# EAGLE design RetroESP32 (EAGLE 9.6.2)

## Sheet 1 of 4: Board and Logos
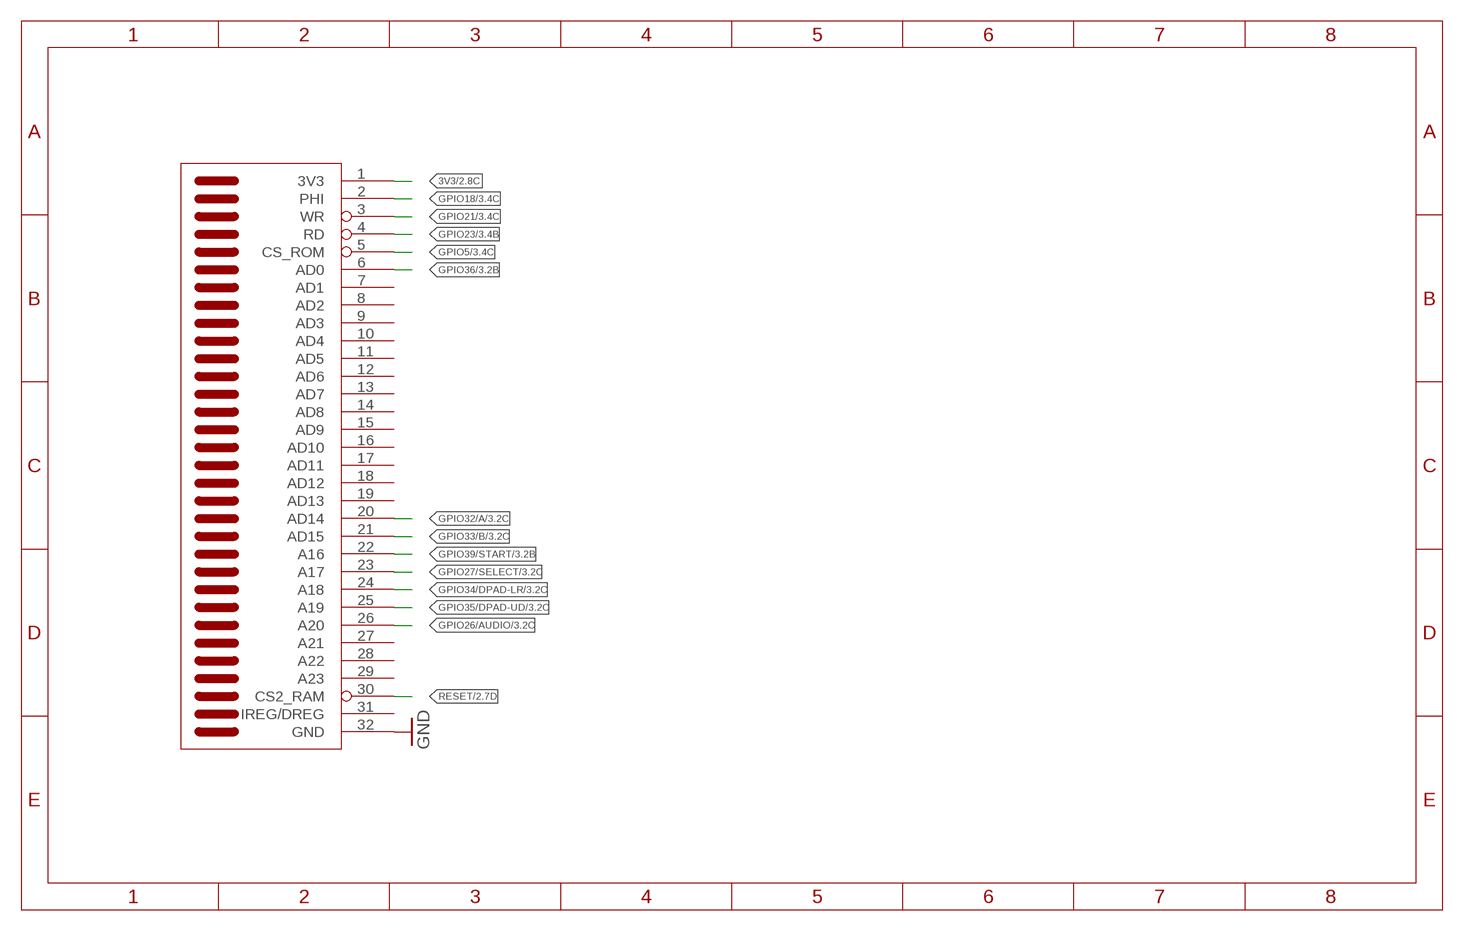
[diagram p0: schematic, sheet 1]

### Parts
U$2  GBA_CARTLARGE  [GBCART]

### Nets
3V3: U$2.1(3V3) ; also sheet 2,3,4
GND: U$2.32(GND) ; also sheet 2,3,4
GPIO5: U$2.5(CS_ROM) ; also sheet 3
GPIO18: U$2.2(PHI) ; also sheet 3,4
GPIO21: U$2.3(WR) ; also sheet 3
GPIO23: U$2.4(RD) ; also sheet 3,4
GPIO26/AUDIO: U$2.26(A20) ; also sheet 3
GPIO27/SELECT: U$2.23(A17) ; also sheet 3
GPIO32/A: U$2.20(AD14) ; also sheet 3
GPIO33/B: U$2.21(AD15) ; also sheet 3
GPIO34/DPAD-LR: U$2.24(A18) ; also sheet 3
GPIO35/DPAD-UD: U$2.25(A19) ; also sheet 3
GPIO36: U$2.6(AD0) ; also sheet 3
GPIO39/START: U$2.22(A16) ; also sheet 3
RESET: U$2.30(CS2_RAM) ; also sheet 2,3
Unconnected: U$2.7(AD1) U$2.8(AD2) U$2.9(AD3) U$2.10(AD4) U$2.11(AD5) U$2.12(AD6) U$2.13(AD7) U$2.14(AD8) U$2.15(AD9) U$2.16(AD10) U$2.17(AD11) U$2.18(AD12) U$2.19(AD13) U$2.27(A21) U$2.28(A22) U$2.29(A23) U$2.31(IREG/DREG)

## Sheet 2 of 4: USB UART
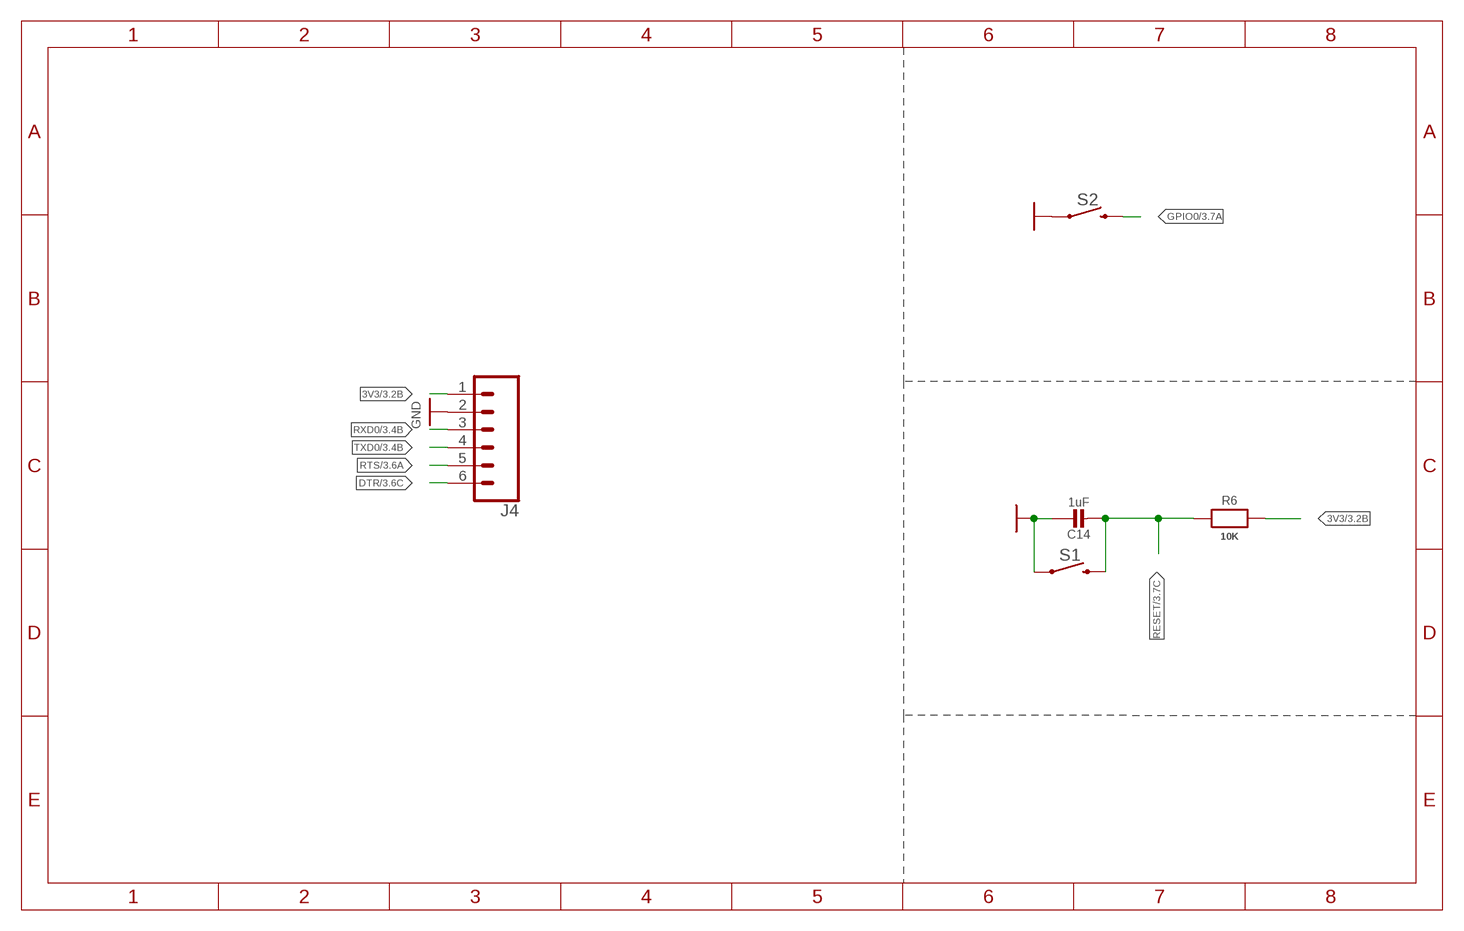
[diagram p1: schematic, sheet 2]

### Parts
C14  1uF  CAP_CERAMIC  [0603-MINI-CAP]
J4  CONN_06NO_SILK_NO_POP  [1X06_NO_SILK]
R6  10K  RESISTOR0603MINI  [0603-MINI]
S1  SWITCHES_MOMENTARY-SWITCH-SPST-SMD-4.6X2.8MM  [SWITCHES_TACTILE_SWITCH_SMD_4.6X2.8MM]
S2  SWITCHES_MOMENTARY-SWITCH-SPST-SMD-4.6X2.8MM  [SWITCHES_TACTILE_SWITCH_SMD_4.6X2.8MM]

### Nets
3V3: J4.1 R6.2 ; also sheet 1,3,4
DTR: J4.6 ; also sheet 3
GND: C14.1 J4.2 S1.1 S1.2 S2.1 S2.2 ; also sheet 1,3,4
GPIO0: S2.3 S2.4 ; also sheet 3
RESET: C14.2 R6.1 S1.3 S1.4 ; also sheet 1,3
RTS: J4.5 ; also sheet 3
RXD0: J4.3 ; also sheet 3
TXD0: J4.4 ; also sheet 3

## Sheet 3 of 4: ESP32 CORE
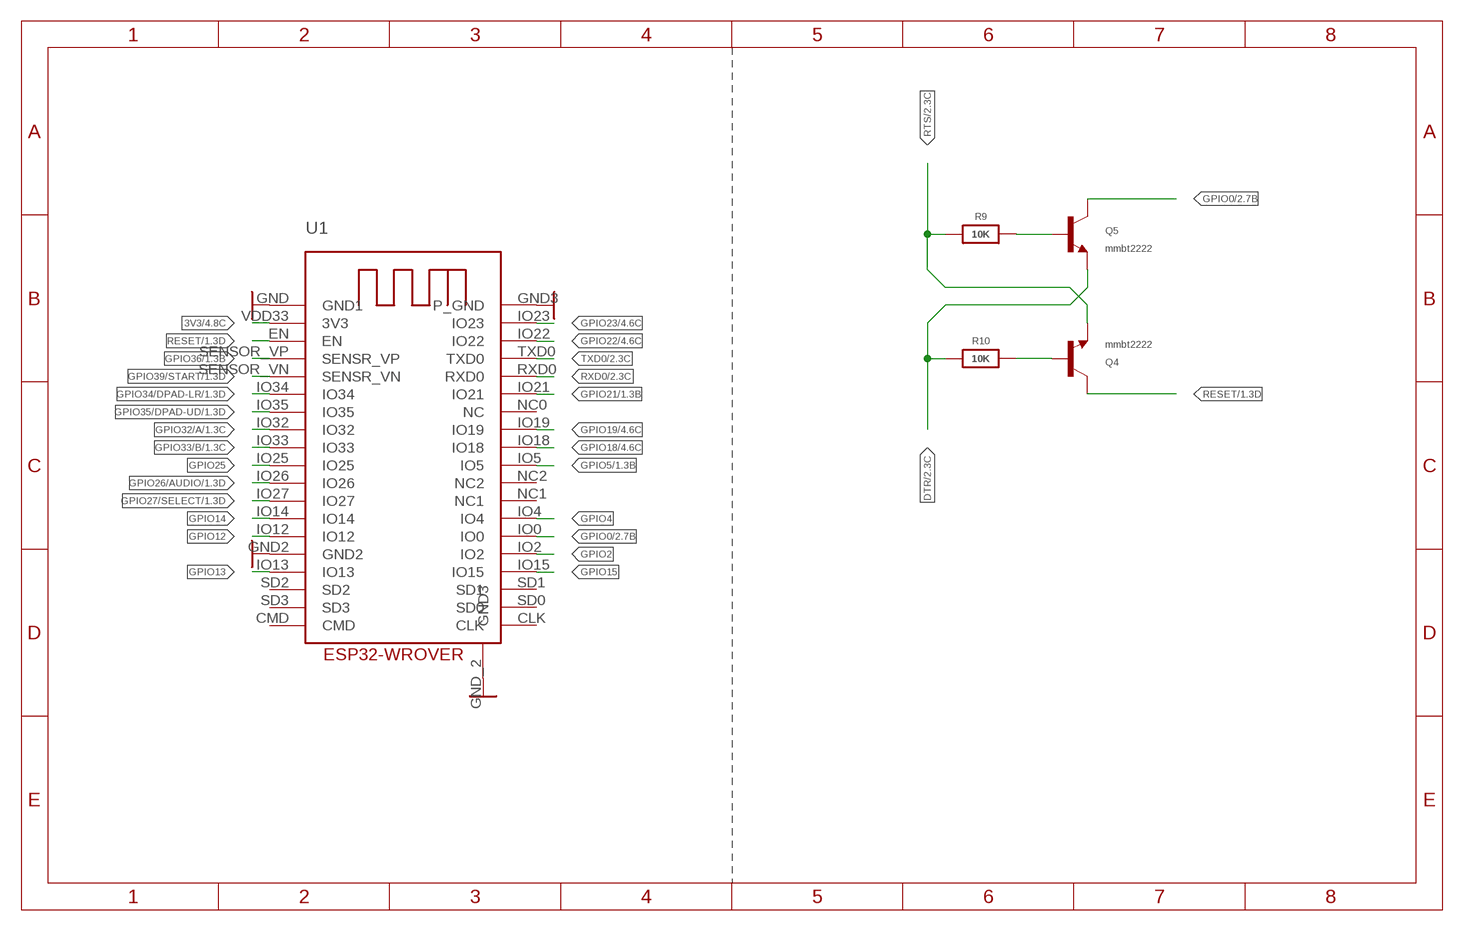
[diagram p2: schematic, sheet 3]

### Parts
Q4  mmbt2222  TRANSISTOR_NPNSOT23-3  [SOT23-3]
Q5  mmbt2222  TRANSISTOR_NPNSOT23-3  [SOT23-3]
R9  10K  RESISTOR0603MINI  [0603-MINI]
R10  10K  RESISTOR0603MINI  [0603-MINI]
U1  ESP32-WROVER_ESP32-WROVER  [ESP32-WROVER_ESP32-WROVER]

### Nets
3V3: U1.VDD33(3V3) ; also sheet 1,2,4
DTR: Q5.2(E) R10.1 ; also sheet 2
GND: U1.GND2 U1.GND3(P_GND) U1.GND(GND1) U1.GND_2(GND3) ; also sheet 1,2,4
GPIO0: Q5.3(C) U1.IO0 ; also sheet 2
GPIO2: U1.IO2
GPIO4: U1.IO4
GPIO5: U1.IO5 ; also sheet 1
GPIO12: U1.IO12
GPIO13: U1.IO13
GPIO14: U1.IO14
GPIO15: U1.IO15
GPIO18: U1.IO18 ; also sheet 1,4
GPIO19: U1.IO19 ; also sheet 4
GPIO21: U1.IO21 ; also sheet 1
GPIO22: U1.IO22 ; also sheet 4
GPIO23: U1.IO23 ; also sheet 1,4
GPIO25: U1.IO25
GPIO26/AUDIO: U1.IO26 ; also sheet 1
GPIO27/SELECT: U1.IO27 ; also sheet 1
GPIO32/A: U1.IO32 ; also sheet 1
GPIO33/B: U1.IO33 ; also sheet 1
GPIO34/DPAD-LR: U1.IO34 ; also sheet 1
GPIO35/DPAD-UD: U1.IO35 ; also sheet 1
GPIO36: U1.SENSOR_VP(SENSR_VP) ; also sheet 1
GPIO39/START: U1.SENSOR_VN(SENSR_VN) ; also sheet 1
RESET: Q4.3(C) U1.EN ; also sheet 1,2
RST-RES: Q4.1(B) R10.2
RTS: Q4.2(E) R9.1 ; also sheet 2
RTS-RES: Q5.1(B) R9.2
RXD0: U1.RXD0 ; also sheet 2
TXD0: U1.TXD0 ; also sheet 2
Unconnected: U1.CLK U1.CMD U1.NC0(NC) U1.NC1 U1.NC2 U1.SD0 U1.SD1 U1.SD2 U1.SD3

## Sheet 4 of 4: USB + BATTERY
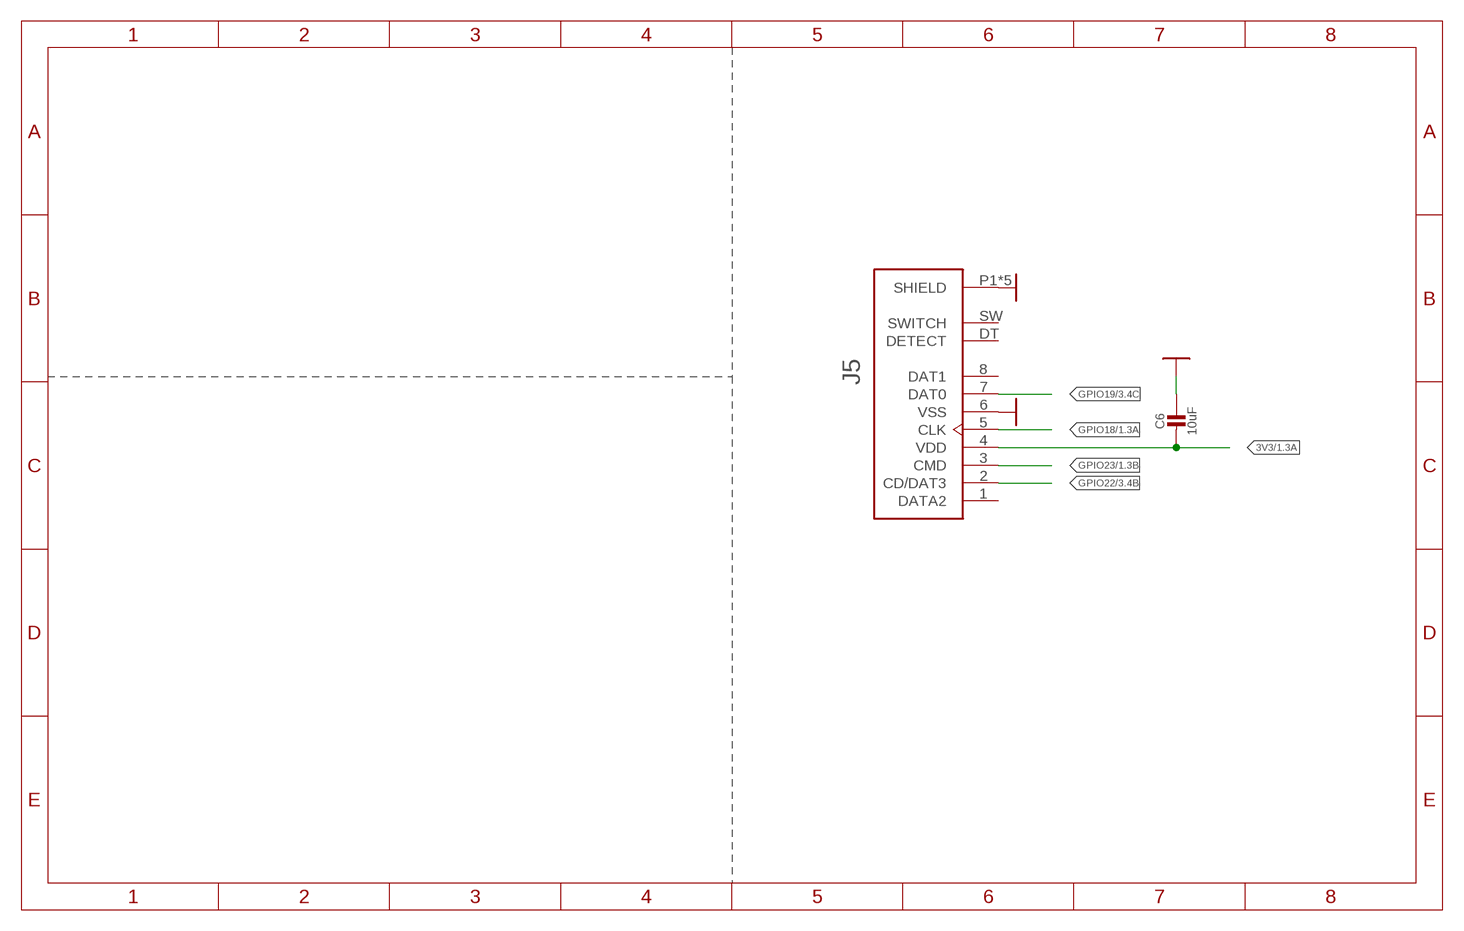
[diagram p3: schematic, sheet 4]

### Parts
C6  10uF  CAP_CERAMIC  [0603-MINI-CAP]
J5  503182-1852_503182-1852  [503182-1852_MOLEX_503182-1852]

### Nets
3V3: C6.2 J5.4(VDD) ; also sheet 1,2,3
GND: C6.1 J5.6(VSS) J5.P1(SHIELD) J5.P2(SHIELD) J5.P3(SHIELD) J5.P4(SHIELD) J5.P5(SHIELD) ; also sheet 1,2,3
GPIO18: J5.5(CLK) ; also sheet 1,3
GPIO19: J5.7(DAT0) ; also sheet 3
GPIO22: J5.2(CD/DAT3) ; also sheet 3
GPIO23: J5.3(CMD) ; also sheet 1,3
Unconnected: J5.1(DATA2) J5.8(DAT1) J5.DT(DETECT) J5.SW(SWITCH)

## Library data of the parts
C6 = RetroESP32:CAP_CERAMIC: Ceramic Capacitors For new designs, use the packages preceded by an '_' character since they are more reliable: The following footprints should be used on most boards: _0402 - Standard footprint for regular board layouts _0603 - Standard footprint for regular board layouts _0805 - Standard footprint for regular board layouts _1206 - Standard footprint for regular board layouts For extremely tight-pitch boards where space is at a premium, the following 'micro-pitch' footprints can be used (smaller pads, no silkscreen outline, etc.): _0402MP - Micro-pitch footprint for very dense/compact boards _0603MP - Micro-pitch footprint for very dense/compact boards _0805MP - Micro-pitch footprint for very dense/compact boards _1206MP - Micro-pitch footprint for very dense/compact boards; MPN: CL10A106MP8NNNC
C14 = RetroESP32:CAP_CERAMIC: Ceramic Capacitors For new designs, use the packages preceded by an '_' character since they are more reliable: The following footprints should be used on most boards: _0402 - Standard footprint for regular board layouts _0603 - Standard footprint for regular board layouts _0805 - Standard footprint for regular board layouts _1206 - Standard footprint for regular board layouts For extremely tight-pitch boards where space is at a premium, the following 'micro-pitch' footprints can be used (smaller pads, no silkscreen outline, etc.): _0402MP - Micro-pitch footprint for very dense/compact boards _0603MP - Micro-pitch footprint for very dense/compact boards _0805MP - Micro-pitch footprint for very dense/compact boards _1206MP - Micro-pitch footprint for very dense/compact boards; MPN: CL10A105KP8NNNC
J4 = SparkFun-Connectors:CONN_06: Multi connection point. Often used as Generic Header-pin footprint for 0.1 inch spaced/style header connections On any of the 0.1 inch spaced packages, you can populate with these: Break Away Headers - Straight <https://www.sparkfun.com/products/116> (PRT-00116) Break Away Male Headers - Right Angle <https://www.sparkfun.com/products/553> (PRT-00553) Female Headers <https://www.sparkfun.com/products/115> (PRT-00115) Break Away Headers - Machine Pin <https://www.sparkfun.com/products/117> (PRT-00117) Break Away Female Headers - Swiss Machine Pin <https://www.sparkfun.com/products/743> (PRT-00743) Arduino Stackable Header - 6 Pin <https://www.sparkfun.com/products/9280> (PRT-09280) For SCREWTERMINALS and SPRING TERMINALS visit here: Screw Terimnals on SparkFun.com <https://www.sparkfun.com/search/results?term=Screw+Terminals> (5mm/3.5mm/2.54mm spacing) This device is also useful as a general connection point to wire up your design to another part of your project. Our various solder wires solder well into these plated through hole pads. Hook-Up Wire - Assortment (Stranded, 22 AWG) <https://www.sparkfun.com/products/11375> (PRT-11375) Hook-Up Wire - Assortment (Solid Core, 22 AWG) <https://www.sparkfun.com/products/11367> (PRT-11367) View the entire wire category on our website here <https://www.sparkfun.com/categories/141>
J5 = RetroESP32:503182-1852_503182-1852: Conn Micro SD Card M 8 POS 1.09mm Solder RA SMD Embossed T/R 0.5A/Contact; DESCRIPTION: MICRO SD NORMAL ULTRALOWPRO8CKTE; DIGI-KEY_PART_NUMBER: WM12834CT-ND; DIGI-KEY_PURCHASE_URL: https://www.digikey.ca/product-detail/en/molex/5031821852/WM12834CT-ND/5823232?utm_source=snapeda&utm_medium=aggregator&utm_campaign=symbol; MF: Molex; MP: 5031821852; MPN: 5031821852; PACKAGE: None
Q4 Q5 = RetroESP32:TRANSISTOR_NPN: Transistor NPN BJT configuration in SOT23 package. MMBT2222 is the common NPN we use. Double check BCE configuration again layout.; MPN: MMBT2222A-7-F
R6 R9 R10 = RetroESP32:RESISTOR: Resistors For new designs, use the packages preceded by an '_' character since they are more reliable: The following footprints should be used on most boards: _0402 - Standard footprint for regular board layouts _0603 - Standard footprint for regular board layouts _0805 - Standard footprint for regular board layouts _1206 - Standard footprint for regular board layouts For extremely tight-pitch boards where space is at a premium, the following 'micro-pitch' footprints can be used (smaller pads, no silkscreen outline, etc.): _0402MP - Micro-pitch footprint for very dense/compact boards _0603MP - Micro-pitch footprint for very dense/compact boards _0805MP - Micro-pitch footprint for very dense/compact boards _1206MP - Micro-pitch footprint for very dense/compact boards; MPN: ERJ-PA3J103V
S1 S2 = RetroESP32:SWITCHES_MOMENTARY-SWITCH-SPST: Momentary Switch (Pushbutton) - SPST Normally-open (NO) SPST momentary switches (buttons, pushbuttons). Variants PTH-12MM - 12mm square, through-hole Momentary Pushbutton Switch - 12mm Square <https://www.sparkfun.com/products/9190> (COM-09190) PTH-6.0MM, PTH-6.0MM-KIT - 6.0mm square, through-hole Mini Pushbutton Switch <https://www.sparkfun.com/products/97> (COM-00097) KIT package intended for soldering kit's - only one side of pads' copper is exposed. PTH-RIGHT-ANGLE-KIT - Right-angle, through-hole Right Angle Tactile Button <https://www.sparkfun.com/products/10791> - Used on SparkFun BigTime Watch Kit <https://www.sparkfun.com/products/11734> SMD-12MM - 12mm square, surface-mount Tactile Button - SMD (12mm) <https://www.sparkfun.com/products/12993> (COM-12993) Used on SparkFun PicoBoard <https://www.sparkfun.com/products/11888> SMD-4.5MM - 4.5mm Square Trackball Switch Used on SparkFun Blackberry Trackballer Breakout <https://www.sparkfun.com/products/13169> SMD-4.6MMX2.8MM - 4.60mm x 2.80mm, surface mount Used on SparkFun SAMD21 Mini Breakout <https://www.sparkfun.com/products/13664> SMD-5.2MM, SMD-5.2-REDUNDANT - 5.2mm square, surface-mount Mini Pushbutton Switch - SMD <https://www.sparkfun.com/products/8720> (COM-08720) Used on Arduino Pro Mini <https://www.sparkfun.com/products/11114> REDUNDANT package connects both switch circuits together SMD-6.0X3.5MM - 6.0 x 3.5mm, surface mount Momentary Reset Switch SMD <https://www.sparkfun.com/products/8229> (COM-08229) SMD-6.2MM-TALL - 6.2mm square, surface mount Tactile Button - SMD (6mm) <https://www.sparkfun.com/products/12992> Used on SparkFun Digital Sandbox <https://www.sparkfun.com/products/12651> SMD-RIGHT-ANGLE - Right-angle, surface mount Used on SparkFun Block for Intel® Edison - Arduino <https://www.sparkfun.com/products/13036>; MPN: KMR221GLFS; PROD_ID: COMP-12265; SF_SKU: COM-12993
U1 = RetroESP32:ESP32-WROVER_ESP32-WROVER; MPN: ESP32-WROVER (16MB)
U$2 = gameboy:GBA_CART

## Board
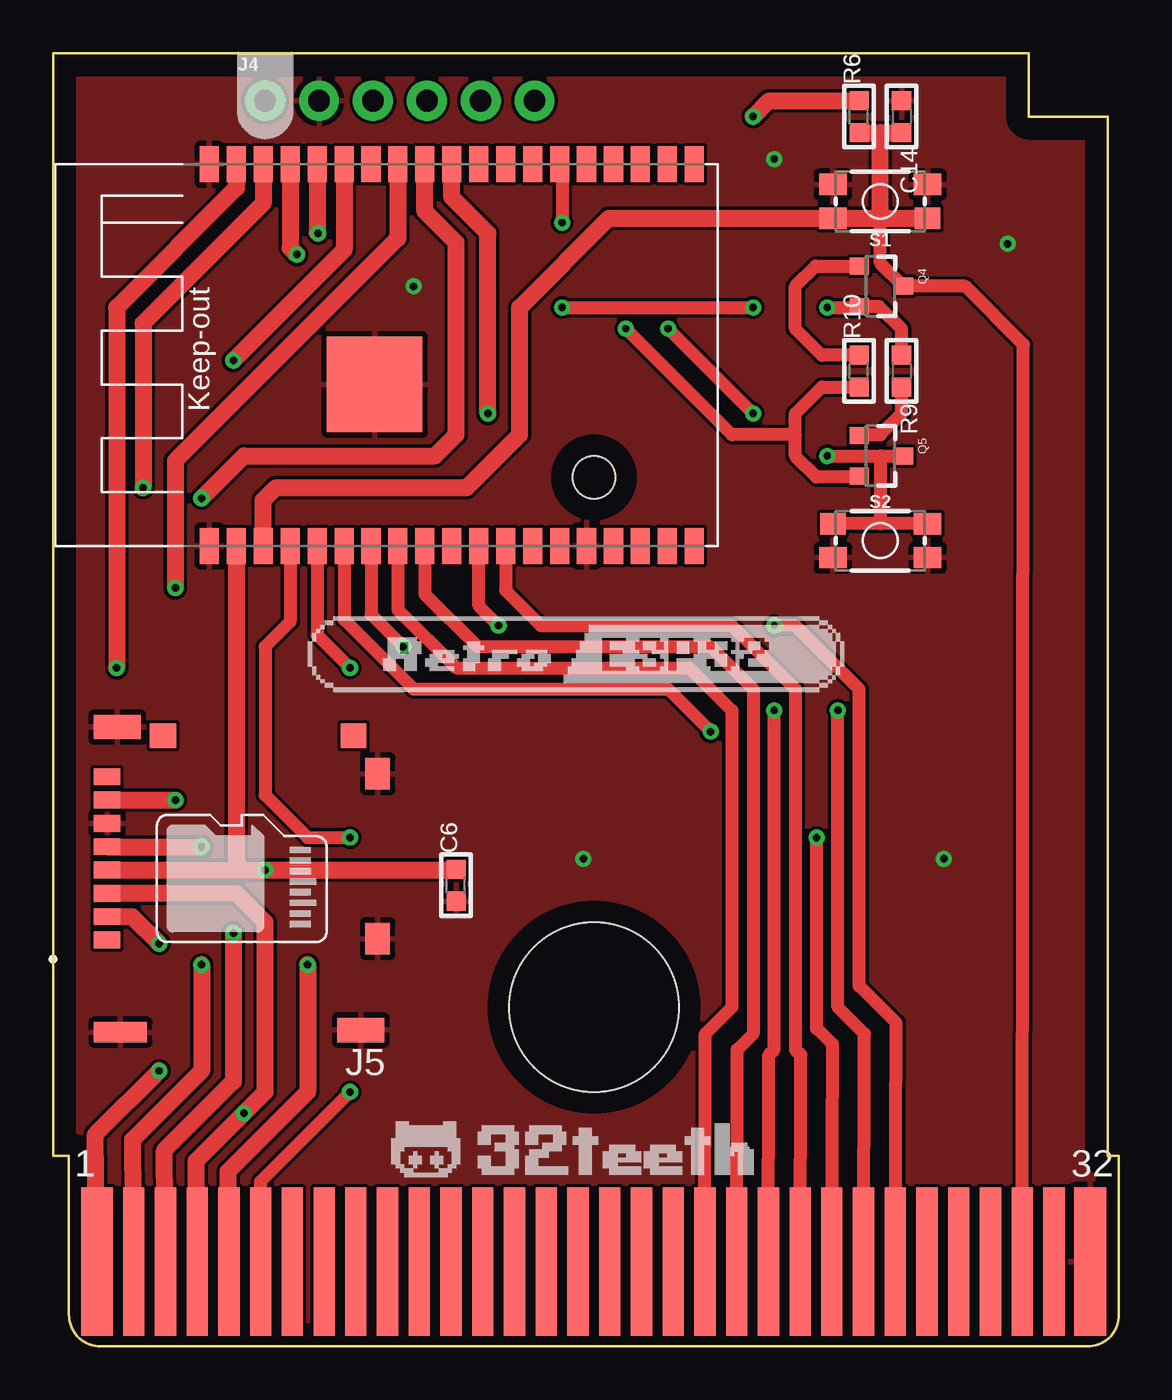
[diagram p4: board, top side]
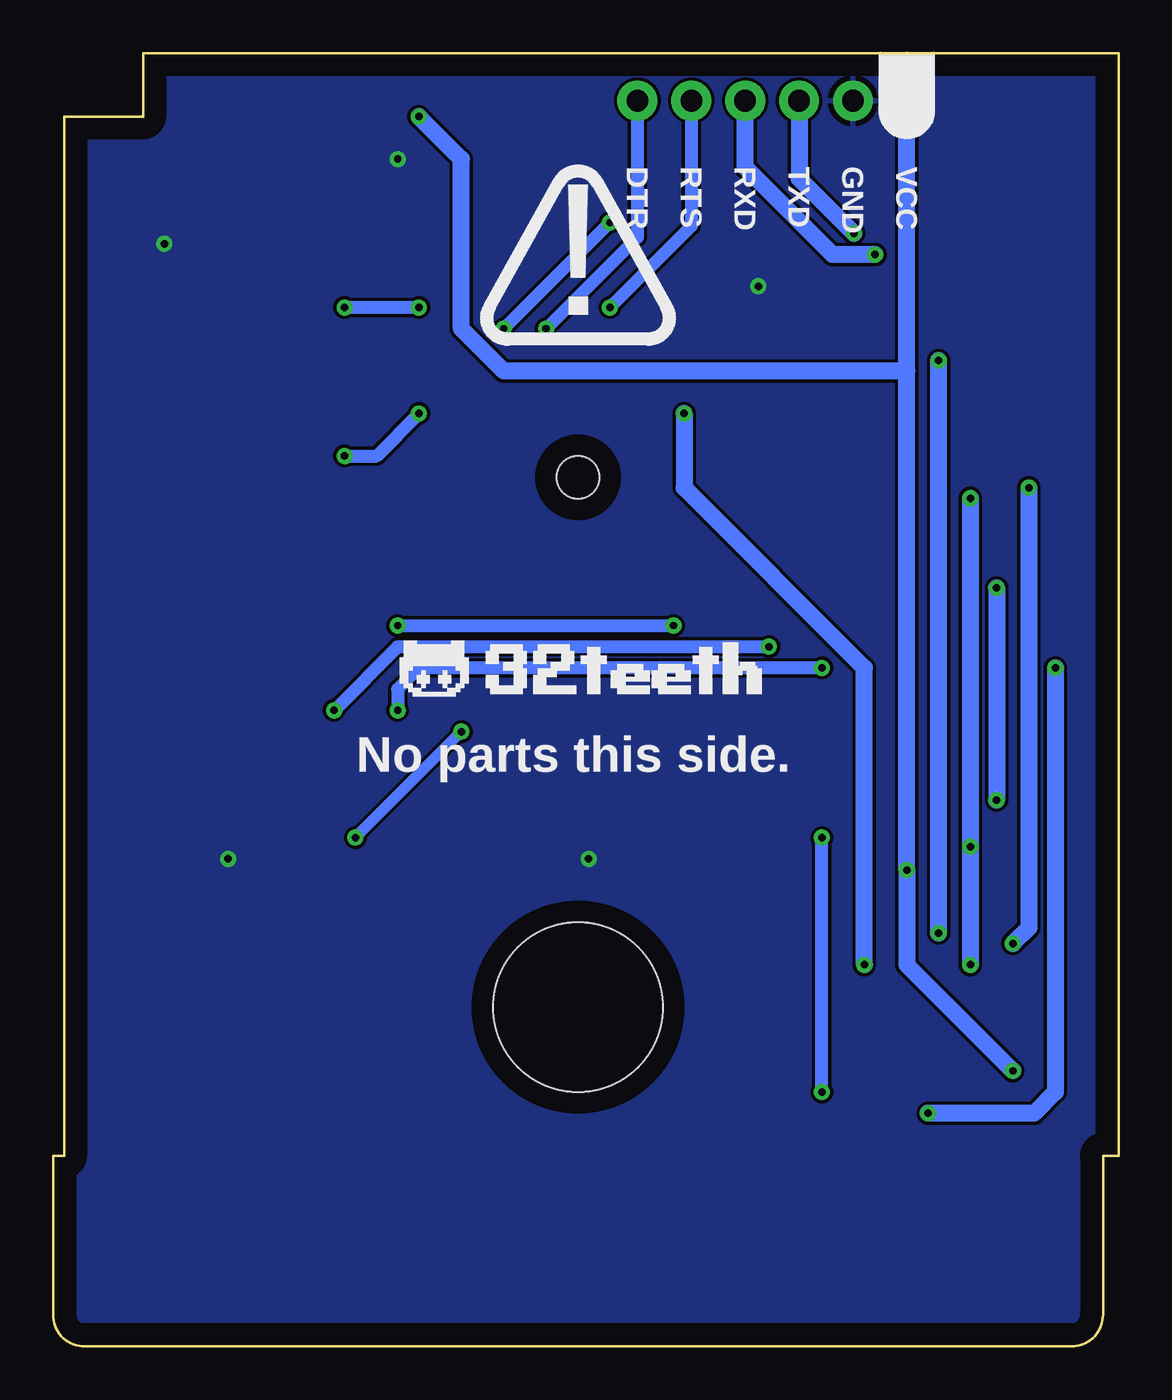
[diagram p5: board, bottom side, seen from below]

Size 50.25 x 61 mm. Coordinates in mm from the lower left corner, seen from the top.
Copper layers (1*16): Top 0.035mm / dielectric 1.5mm / Bottom 0.035mm
Design rules "default": minimum track width 6mil, minimum drill 0.35mm, track to track 6mil, track to pad 6mil, pad to pad 6mil, via to via 6mil, smd to smd 6mil, copper to edge 40mil, drill to drill 6mil, minimum pad ring 10mil, minimum via ring 8mil, stop-mask expansion 4mil, vias tented up to drill 0mil, thermal gap 10mil

### Footprints (pad centres in the part's own frame; a part is rotated, then mirrored left to right if it is on the bottom)
0603-MINI-CAP = smd 0.9 x 0.9: 1 -0.75,0; 2 0.75,0
1X06_NO_SILK = drill 1.016 pad 1.88: 1 0,0; 2 2.54,0; 3 5.08,0; 4 7.62,0; 5 10.16,0; 6 12.7,0
503182-1852_MOLEX_503182-1852 = smd 0.8 x 1.24: 1 -2.9,6.355; 2 -1.8,6.355; 3 -0.7,6.355; 4 0.4,6.355; 5 1.5,6.355; 6 2.6,6.355; 7 3.7,6.355; 8 4.8,6.355 | smd 1.16 x 1.2: DT 6.74,-5.275 | smd 0.95 x 2.5: P1 -7.245,5.725 | smd 1.15 x 2.2: P2 7.145,5.875; P3 -7.145,-5.605 | smd 1.5 x 1.15: P4 -2.84,-6.4; P5 4.94,-6.4 | smd 1.16 x 1.25: SW 6.74,3.725
SOT23-3 = smd 0.8 x 0.9: 1 -0.95,-1; 2 0.95,-1; 3 0,1.1
0603-MINI = smd 0.9 x 0.9: 1 -0.75,0; 2 0.75,0
SWITCHES_TACTILE_SWITCH_SMD_4.6X2.8MM = smd 1.3 x 1: 1 -2.23,-0.8; 2 2.23,-0.8; 3 2.23,0.8 | smd 1.2 x 1: 4 -2.23,0.8
ESP32-WROVER_ESP32-WROVER = smd 1.7 x 0.9: CLK 18,1.27; CMD 0,1.27; EN 0,21.59; GND 0,24.13; GND3 18,24.13; GND_2 0,6.35; IO0 18,7.62; IO2 18,6.35; IO4 18,8.89; IO5 18,12.7; IO12 0,7.62; IO13 0,5.08; IO14 0,8.89; IO15 18,5.08; IO18 18,13.97; IO19 18,15.24; IO21 18,17.78; IO22 18,21.59; IO23 18,22.86; IO25 0,12.7; IO26 0,11.43; IO27 0,10.16; IO32 0,15.24; IO33 0,13.97; IO34 0,17.78; IO35 0,16.51; NC0 18,16.51; NC1 18,10.16; NC2 18,11.43; RXD0 18,19.05; SD0 18,2.54; SD1 18,3.81; SD2 0,3.81; SD3 0,2.54; SENSOR_VN 0,19.05; SENSOR_VP 0,20.32; TXD0 18,20.32; VDD33 0,22.86 | smd 4.5 x 4.5: GND2 7.62,16.34
GBCART = smd 1.5 x 7: 1 2.07,4; 32 48.9,4 | smd 1 x 7: 2 3.803,4; 3 5.299,4; 4 6.795,4; 5 8.291,4; 6 9.787,4; 7 11.283,4; 8 12.78,4; 9 14.276,4; 10 15.772,4; 11 17.268,4; 12 18.764,4; 13 20.26,4; 14 21.756,4; 15 23.252,4; 16 24.748,4; 17 26.244,4; 18 27.74,4; 19 29.236,4; 20 30.732,4; 21 32.228,4; 22 33.724,4; 23 35.22,4; 24 36.716,4; 25 38.213,4; 26 39.709,4; 27 41.205,4; 28 42.701,4; 29 44.197,4; 30 45.693,4; 31 47.189,4 | hole 8: 25.5,16 | hole 2: 25.5,41

### Placement (x,y rotation side)
C6  19,21.75 90 top
C14  40,58 270 top
J4  10,58.75 0 top
J5  8.9,22.07 90 top
Q4  39,50 270 top
Q5  39,42 270 top
R6  38,58 90 top
R9  40,46 270 top
R10  38,46 90 top
S1  39,54 180 top
S2  39,38 0 top
U1  31.5,37.75 90 top
U$2  0,0 0 top

### Tracks (layer width: path | path; a pad name or v marks a point on that pad's centre or on a via)
3V3  (via drill 0.35)
  Top 0.813: U$2.1 2,10 v5,13 | J5.4 9,22.47 | 9,22.47 v10,22.47 18.97,22.47 C6.2 | U1.VDD33 8.64,22.83 9,22.47 | v33,58 33.75,58.75 R6.2
  Bottom 0.813: v5,13 10,18 v10,22.47 10,46 | 10,46 J4.1 | 10,46 29,46 31,48 31,56 v33,58
DTR  (via drill 0.35)
  Top 0.406: Q5.2 37.95,41
  Top 0.61: 37.95,41 36,41 35,42 35,43 | 35,43 35,44 36.25,45.25 R10.1 | 35,43 32,43 v27,48
  Bottom 0.61: J4.6 22.7,52.3 v27,48
GND  (via drill 0.35)
  other vias: 34,56 45,52 42,23 25,23 17,50
  pour Top (rank 2): 0,0 49.75,0 49.75,58 46,58 46,61 0,61
  pour Bottom: 0,0 0,61 46,61 46,58 49.75,58 49.75,0
GPIO0  (via drill 0.35)
  Top 0.406: U1.IO0 24,55.63 | 39,38.8 S2.3
  Top 0.61: 24,55.63 v24,53 | v33,44 v29,48 | v36.5,42 39,42 | 39,42 Q5.3 | 39,42 39,38.8 | S2.3 S2.4
  Bottom 0.61: v36.5,42 35,42 v33,44 | v29,48 v24,53
GPIO5  (via drill 0.35)
  Top 0.813: U$2.5 8.25,8.25 12,12 v12,18 | v20.5,44 20.5,52.5 18.8,54.2 U1.IO5
  Bottom 0.813: v12,18 12,32 20.5,40.5 v20.5,44
GPIO18  (via drill 0.35)
  Top 0.813: U$2.2 3.75,9.75 7,13 v7,18 | J5.5 v7,23.57 | U1.IO18 17.53,53.53 19,52.06 19,43 18,42 9,42 v7,40
  Bottom 0.813: v7,18 v7,23.57 v7,40
GPIO19  (via drill 0.35)
  Top 0.813: U1.IO19 16.26,52.26 5.77,41.77 v5.77,35.77 | J5.7 v5.77,25.77
  Bottom 0.813: v5.77,35.77 v5.77,25.77
GPIO21  (via drill 0.35)
  Top 0.813: U$2.3 5.25,9.25 8.5,12.5 v8.5,19.5 | U1.IO21 13.72,51.72 v8.5,46.5
  Bottom 0.813: v8.5,19.5 v8.5,46.5
GPIO22  (via drill 0.35)
  Top 0.813: U1.IO22 9.91,53.91 4.25,48.25 v4.25,40.5 | J5.2 3.73,20.27 v5,19
  Bottom 0.813: v4.25,40.5 4.25,19.75 v5,19
GPIO23  (via drill 0.35)
  Top 0.813: U$2.4 6.75,8.75 v9,11 10,12 10,20 8.63,21.37 J5.3 | U1.IO23 8.64,54.64 3,49 v3,32
  Bottom 0.813: v3,32 3,12 4,11 v9,11
GPIO26/AUDIO  (via drill 0.35)
  Top 0.61: U$2.26 39.75,15.25 38,17 38,31 35,34 v34,34 | v21,34 20.07,34.93 U1.IO26
  Bottom 0.61: v34,34 v21,34
GPIO27/SELECT
  Top 0.61: U$2.23 35.25,13.75 35,14 35,31 32,34 23,34 21.34,35.66 U1.IO27
GPIO32/A
  Top 0.61: U$2.20 30.75,14.75 32,16 32,30 30,32 19,32 16.26,34.74 U1.IO32
GPIO33/B
  Top 0.61: U$2.21 32.25,14 33,14.75 33,31 31,33 20,33 17.53,35.47 U1.IO33
GPIO34/DPAD-LR  (via drill 0.35)
  Top 0.61: U$2.24 36.75,14.25 36,15 v36,24 | U1.IO34 13.72,34.28 17,31 29,31 v31,29
  Bottom 0.508: v31,29 v36,24
GPIO35/DPAD-UD  (via drill 0.35)
  Top 0.61: U$2.25 38.25,14.75 37,16 v37,30 | U1.IO35 14.99,34.51 v16.5,33
  Bottom 0.61: v37,30 34,33 v16.5,33
GPIO36  (via drill 0.35)
  Top 0.61: U1.SENSOR_VP 11.18,34.18 10,33 10,26 12,24 v14,24 | U$2.6 9.79,7.79 v14,12
  Bottom 0.61: v14,12 v14,24
GPIO39/START  (via drill 0.35)
  Top 0.61: U$2.22 33.75,13.75 34,14 v34,30 | U1.SENSOR_VN 12.45,33.55 v14,32
  Bottom 0.61: v14,32 33,32 34,31 v34,30
RESET
  Top 0.61: 39,53.2 39,51.1 Q4.3 43,50 45.75,47.25 U$2.30
  Top 0.813: U1.EN 9.91,39.91 10.5,40.5 19.5,40.5 22,43 22,49 26.2,53.2 S1.3 39,53.2 | 39,53.2 S1.4 | 39,53.2 39,57.25 | 39,57.25 C14.2 | R6.1 39,57.25
RST-RES
  Top 0.61: R10.2 36.25,46.75 35,48 35,50 35.95,50.95 Q4.1
RTS  (via drill 0.35)
  Top 0.406: 37.95,49 Q4.2
  Top 0.61: R9.1 40,48 38.95,49.05 Q4.2 | v24,49 v33,49 | v36.5,49 37.95,49
  Bottom 0.61: J4.5 20.16,52.84 v24,49 | v33,49 v36.5,49
RTS-RES
  Top 0.406: Q5.1 38.05,43
  Top 0.61: 38.05,43 39,43 40,44 R9.2
RXD0  (via drill 0.35)
  Top 0.813: U1.RXD0 12.45,52.55 v12.5,52.5
  Bottom 0.813: J4.3 15.08,55.08 v12.5,52.5
TXD0  (via drill 0.35)
  Top 0.813: U1.TXD0 11.18,51.82 v11.5,51.5
  Bottom 0.813: J4.4 17.62,55.62 13.5,51.5 v11.5,51.5

### Text on the board
bNames: VCC | GND | TXD | RXD | RTS | DTR